# EAGLE design 11Dof Half (EAGLE 5.11)
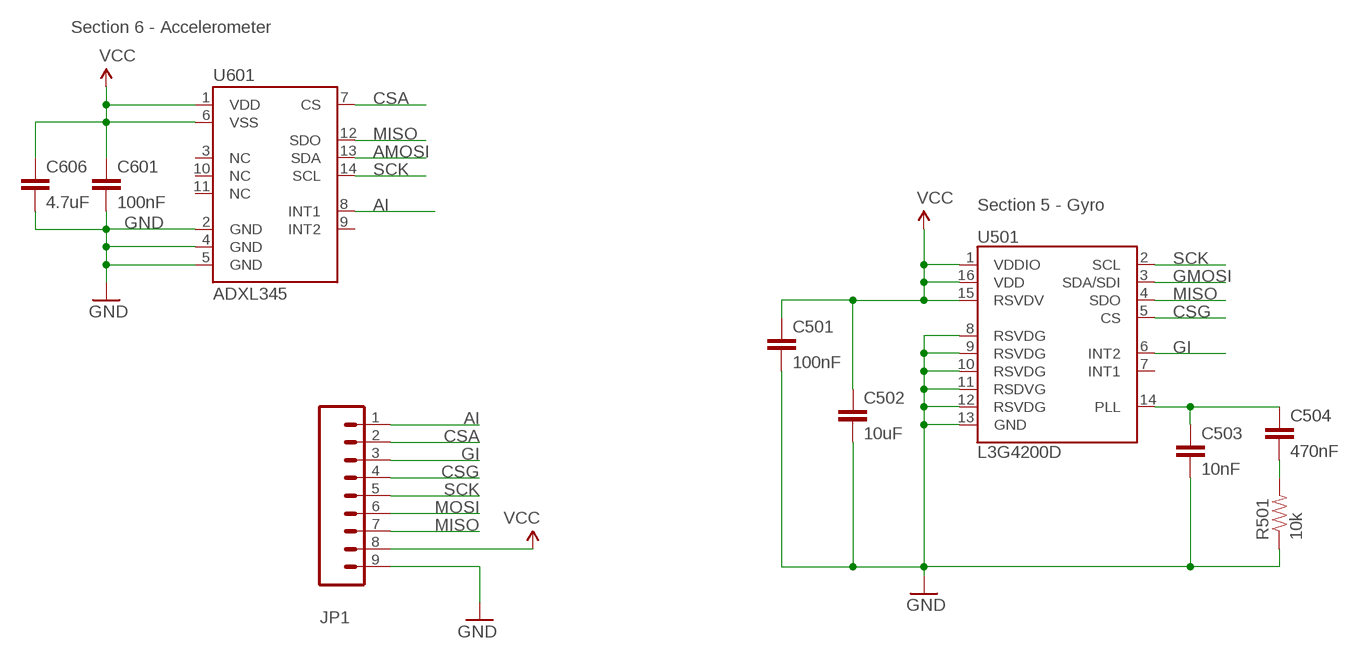
[diagram p0: schematic, sheet 1]

## Parts
C501  100nF  CAP0402-CAP  [0402-CAP]
C502  10uF  CAP0603-CAP  [0603-CAP]
C503  10nF  CAP0402-CAP  [0402-CAP]
C504  470nF  CAP0402-CAP  [0402-CAP]
C601  100nF  CAP0402-CAP  [0402-CAP]
C606  4.7uF  CAP0402-CAP  [0402-CAP]
JP1  M09  [1X09]
R501  10k  RESISTOR0402-RES  [0402-RES]
U501  L3G4200D  [LGA16-4X4]
U601  ADXL345  [LGA14]

## Nets
AI: JP1.1 U601.8(INT1)
AMOSI: U601.13(SDA)
CSA: JP1.2 U601.7(CS)
CSG: JP1.4 U501.5(CS)
GI: JP1.3 U501.6(INT2)
GMOSI: U501.3(SDA/SDI)
GND: C501.2 C502.2 C503.2 C601.2 C606.2 JP1.9 R501.1 U501.8(RSVDG) U501.9(RSVDG) U501.10(RSVDG) U501.11(RSDVG) U501.12(RSVDG) U501.13(GND) U601.2(GND) U601.4(GND) U601.5(GND)
MISO: JP1.7 U501.4(SDO) U601.12(SDO)
MOSI: JP1.6
N$1: C503.1 C504.1 U501.14(PLL)
N$2: C504.2 R501.2
SCK: JP1.5 U501.2(SCL) U601.14(SCL)
VCC [POWER]: C501.1 C502.1 C601.1 C606.1 JP1.8 U501.1(VDDIO) U501.15(RSVDV) U501.16(VDD) U601.1(VDD) U601.6(VSS)
Unconnected: U501.7(INT1) U601.3(NC) U601.9(INT2) U601.10(NC) U601.11(NC)

## Notes on the sheet
- Section 6 - Accelerometer
- Section 5 - Gyro

## Library data of the parts
C501-C504 C601 C606 = SparkFun:CAP: Capacitor Standard 0603 ceramic capacitor, and 0.1" leaded capacitor.
JP1 = SparkFun:M09: Header 9 Standard 9-pin 0.1" header. Use with straight break away headers (SKU : PRT-00116), right angle break away headers (PRT-00553), swiss pins (PRT-00743), machine pins (PRT-00117), and female headers (PRT-00115).
R501 = SparkFun:RESISTOR: Resistor Basic schematic elements and footprints for 0603, 1206, and PTH resistors.
U501 = SparkFun:L3G4200D: L3G4200D Three-axis, digital output gyroscope The L3G4200D is a low-power three-axis angular rate sensor, has a full scale of ±250/±500/±2000 dps and is capable of measuring rates with a user-selectable bandwidth. It includes a sensing element and an IC interface capable of providing the measured angular rate to the external world through a digital interface (I2C/SPI). Package: 4x4x1.1 LGA-16 (LGA16-4x4.PAC)
U601 = SparkFun:ADXL345

## Net classes
0 default: width 0.152 mm, drill 0.33 mm, clearance 0.152 mm
1 POWER: width 0.152 mm, drill 0.33 mm, clearance 0.152 mm
2 hv: width 0.152 mm, drill 0.33 mm, clearance 0.152 mm

## Board
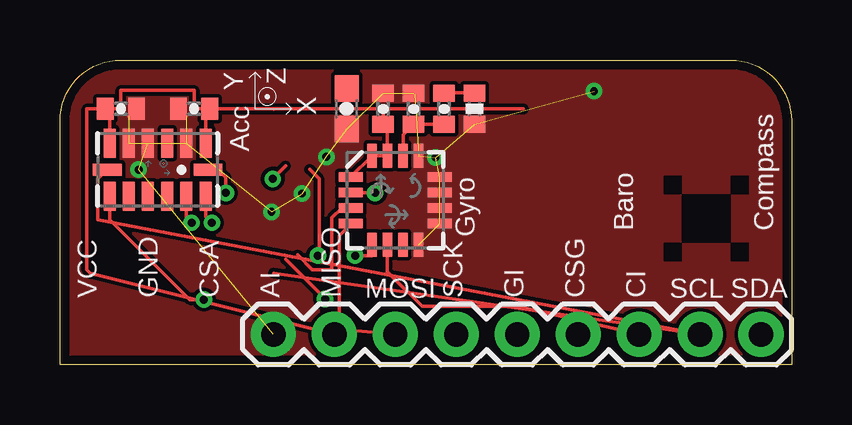
[diagram p1: board, top side]
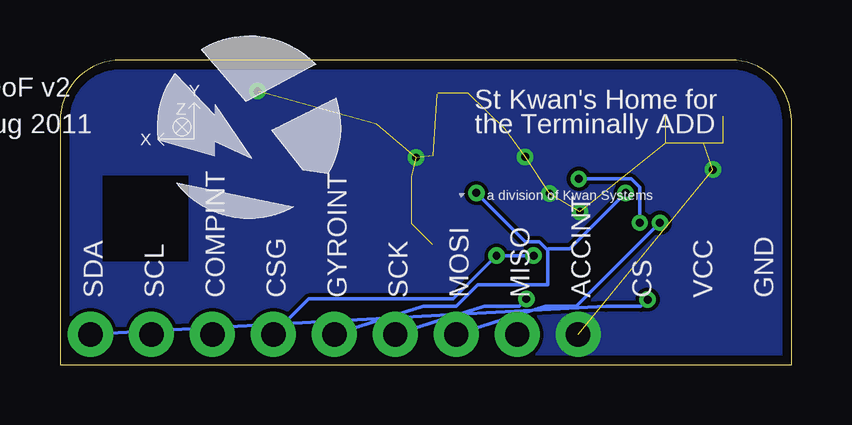
[diagram p2: board, bottom side, seen from below]

Size 30.48 x 12.7 mm. Coordinates in mm from the lower left corner, seen from the top.
Outline: 0,0 0,10.16 arc-90 2.54,12.7 27.94,12.7 arc-90 30.48,10.16 30.48,0 0,0
Copper layers (1*16): Top 0.0356mm / dielectric 1.5011mm / Bottom 0.0356mm
Design rules "LaenPCBOrder *": minimum track width 6mil, minimum drill 13mil, track to track 6mil, track to pad 6mil, pad to pad 6mil, via to via 6mil, smd to smd 6mil, copper to edge 15mil, drill to drill 6mil, minimum pad ring 7mil, minimum via ring 7mil, stop-mask expansion 4mil, vias tented up to drill 0mil, thermal gap 10mil
tRestrict: area 25.1,7.1 to 25.9,7.9; area 27.9,7.1 to 28.7,7.9; area 27.9,4.3 to 28.7,5.1; area 25.1,4.3 to 25.9,5.1; area 25.9,5.1 to 27.9,7.1
bRestrict: area 25.1,4.3 to 28.7,7.9

### Footprints (pad centres in the part's own frame; a part is rotated, then mirrored left to right if it is on the bottom)
0402-CAP = smd 0.7 x 0.9: 1 -0.65,0; 2 0.65,0
0603-CAP = smd 1.1 x 1: 1 -0.85,0; 2 0.85,0
1X09 = drill 1.016 pad 1.88 round: 1 0,0; 2 2.54,0; 3 5.08,0; 4 7.62,0; 5 10.16,0; 6 12.7,0; 7 15.24,0; 8 17.78,0; 9 20.32,0
0402-RES = smd 0.7 x 0.9: 1 -0.65,0; 2 0.65,0
LGA16-4X4 = smd 1 x 0.4: 1 -1.85,0.975; 2 -1.85,0.325; 3 -1.85,-0.325; 4 -1.85,-0.975; 9 1.85,-0.975; 10 1.85,-0.325; 11 1.85,0.325; 12 1.85,0.975 | smd 0.4 x 1: 5 -0.975,-1.85; 6 -0.325,-1.85; 7 0.325,-1.85; 8 0.975,-1.85; 13 0.975,1.85; 14 0.325,1.85; 15 -0.325,1.85; 16 -0.975,1.85
LGA14 = smd 0.5 x 1.2: 1 2,1.1; 2 1.2,1.1; 3 0.4,1.1; 4 -0.4,1.1; 5 -1.2,1.1; 6 -2,1.1; 8 -2,-1.1; 9 -1.2,-1.1; 10 -0.4,-1.1; 11 0.4,-1.1; 12 1.2,-1.1; 13 2,-1.1 | smd 1.2 x 0.5: 7 -2.1,0; 14 2.1,0

### Placement (x,y rotation side)
C501  13.46,10.67 90 top
C502  11.94,10.67 270 top
C503  14.73,10.67 90 top
C504  16,10.67 90 top
C601  5.59,10.67 180 top
C606  2.54,10.67 0 top
JP1  29.21,1.27 180 top
R501  17.27,10.67 90 top
U501  13.97,6.86 0 top
U601  4.06,8.13 0 top
U$1  [KWAN_CIRCLE]  22.61,9.91 90 bottom

### Tracks (layer width: path | path; a pad name or v marks a point on that pad's centre or on a via)
AI  (via drill 0.33)
  Top 0.152: U601.8 2.08,7.01 2.08,6.04 5.41,2.72 v5.99,2.72
  Bottom 0.152: v5.99,2.72 6.27,2.44 7.72,2.44 JP1.1
AMOSI  (via drill 0.33)
  Top 0.152: v6.33,5.92 6.07,6.17 6.07,7.01 U601.13 | v8.87,7.75 9.4,8.28
  Bottom 0.152: v8.87,7.75 6.68,7.75 6.33,7.39 v6.33,5.92
CSA
  Top 0.152: U601.7 1.57,7.75 1.57,6.04 JP1.2 8.9,3.82
CSG  (via drill 0.33)
  Top 0.152: v10.74,4.55 10.79,4.6 10.79,7.75 10.4,8.14 | v12.29,4.55 12.98,4.55 12.98,5 U501.5
  Bottom 0.152: v10.74,4.55 v12.29,4.55 14.1,2.74 20.12,2.74 JP1.4
GI
  Top 0.152: JP1.3 19.05,2.44 15.09,2.44 13.64,3.88 U501.6
GMOSI
  Top 0.152: U501.3 11.73,6.53 11.33,6.12 11.33,3.96 10.52,3.96 9.9,4.58
GND  (via drill 0.33)  (21 unrouted)
  Top 0.152: C501.2 | R501.1 17.27,10.01 | C503.2 14.78,11.28 | 5.26,10.36 4.95,10.67 C601.2 | 2.87,10.36 3.17,10.67 C606.2
  other vias: 22.25,11.4 10.08,7.14 8.81,6.38 11.1,8.66 3.28,8.13 15.65,8.64
  pour Top (no thermals): 2.54,12.7 27.94,12.7 arc-90 30.48,10.16 30.48,0 0,0 0,10.16 arc-90
  pour Bottom (no thermals): 2.54,12.7 27.94,12.7 arc-90 30.48,10.16 30.48,0 0,0 0,10.16 arc-90
MISO  (via drill 0.33)
  Top 0.152: JP1.7 11.63,1.47 11.63,5.38 12.12,5.87 U501.4 | 5.28,7.01 U601.12 5.26,6.14 v5.49,5.92
  Bottom 0.152: v5.49,5.92 8.97,2.44 10.26,2.44 JP1.7
MOSI  (via drill 0.33)
  Top 0.152: 9.4,4.39 v11.05,2.74
  Bottom 0.152: v11.05,2.74 11.35,2.44 12.8,2.44 JP1.6
N$1
  Top 0.152: C504.1 16,10.03 14.73,10.03 C503.1 14.29,9.58 U501.14
N$2
  Top 0.152: C504.2 R501.2
SCK  (via drill 0.33)
  Top 0.152: v13.13,7.16 12.14,7.16 U501.2 | 6.17,8.13 U601.14 6.6,8.13 6.91,7.82 v6.91,7.16
  Bottom 0.152: v13.13,7.16 11.1,5.13 10.52,5.13 10.16,4.78 | 10.16,4.78 10.16,3.33 13.08,3.33 13.97,2.44 15.34,2.44 JP1.5 | v6.91,7.16 9.25,4.83 10.11,4.83 10.16,4.78
VCC
  Top 0.152: U501.1 12.14,7.85 12.98,8.69 U501.16 13.06,8.71 13.56,8.71 U501.15 | U501.15 13.64,9.83 13.46,10.01 C501.1 13.46,10.67 | C606.1 1.91,10.67 | 6.22,10.67 6.07,10.52 6.07,9.25 U601.1 | 6.22,10.67 C601.1 7.87,10.67 8.89,10.67 | 13.66,8.31 13.66,8.64 U501.15 | 11.94,10.67 13.46,10.67 | 13.46,10.67 19.3,10.67 | 11.94,10.67 C502.1 | 8.89,10.67 11.94,10.67 | 6.22,10.67 5.59,10.67 5.59,11.43 2.54,11.43 2.54,10.67 C606.1 | JP1.8 1.27,3.81 1.12,3.96 1.12,10.67 C606.1 | 8.89,10.67 8.9,10.66 | U601.6 2.06,10.67 C606.1

### Text on the board
tPlace: Z | Y | X | Acc | Baro | Compass | Gyro | VCC | GND | CSA | AI | MISO | MOSI | SCK | GI | CSG | CI | SCL | SDA
bPlace: St Kwan's Home for | Y | 11DoF v2 | the Terminally ADD | Z | 5 Aug 2011 | X | a division of Kwan Systems
bNames: GND | VCC | CS | ACCINT | MISO | MOSI | SCK | GYROINT | CSG | COMPINT | SCL | SDA